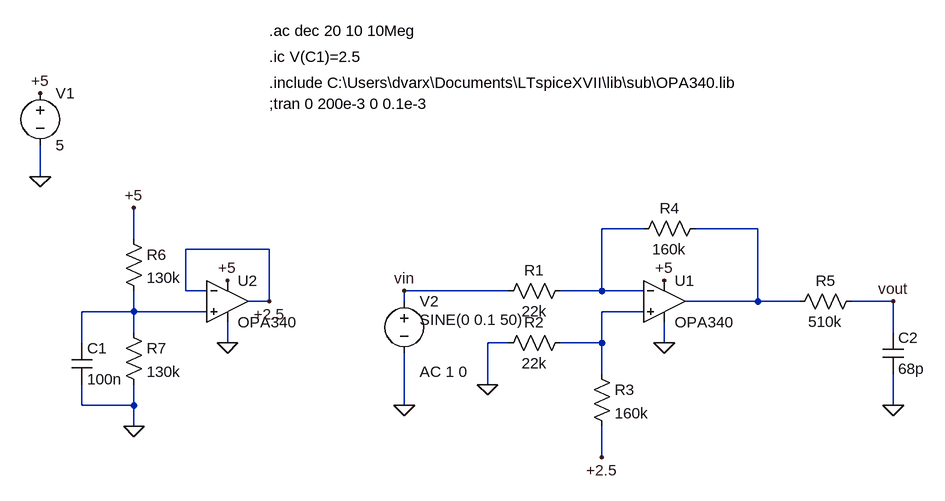
[diagram p0: schematic current_sensor.asc]
current_sensor.asc, the LTspice schematic file:
Version 4
SHEET 1 880 680
WIRE -768 -32 -768 -80
WIRE 160 48 96 48
WIRE 336 48 240 48
WIRE -624 64 -624 16
WIRE -416 80 -544 80
WIRE -544 144 -544 80
WIRE -512 144 -544 144
WIRE -48 144 -208 144
WIRE 96 144 96 48
WIRE 96 144 32 144
WIRE 160 144 96 144
WIRE -416 160 -416 80
WIRE -416 160 -448 160
WIRE -208 160 -208 144
WIRE 336 160 336 48
WIRE 336 160 224 160
WIRE 400 160 336 160
WIRE 544 160 480 160
WIRE -624 176 -624 144
WIRE -624 176 -704 176
WIRE -512 176 -624 176
WIRE 160 176 96 176
WIRE -624 208 -624 176
WIRE 544 208 544 160
WIRE -704 224 -704 176
WIRE -480 224 -480 192
WIRE -48 224 -80 224
WIRE 96 224 96 176
WIRE 96 224 32 224
WIRE 192 224 192 192
WIRE 96 272 96 224
WIRE -80 288 -80 224
WIRE -704 320 -704 288
WIRE -624 320 -624 288
WIRE -624 320 -704 320
WIRE -208 320 -208 240
WIRE 544 320 544 272
WIRE -624 352 -624 320
WIRE 96 400 96 352
FLAG -768 -32 0
FLAG 192 224 0
FLAG -480 224 0
FLAG -768 -160 +5
FLAG -480 128 +5
FLAG -624 16 +5
FLAG -624 352 0
FLAG -416 160 +2.5
FLAG 192 128 +5
FLAG 96 400 +2.5
FLAG -80 288 0
FLAG -208 320 0
FLAG -208 144 vin
FLAG 544 320 0
FLAG 544 160 vout
SYMBOL res 48 128 R90
WINDOW 0 0 56 VBottom 2
WINDOW 3 32 56 VTop 2
SYMATTR InstName R1
SYMATTR Value 22k
SYMBOL res 48 208 R90
WINDOW 0 0 56 VBottom 2
WINDOW 3 32 56 VTop 2
SYMATTR InstName R2
SYMATTR Value 22k
SYMBOL res 80 256 R0
SYMATTR InstName R3
SYMATTR Value 160k
SYMBOL res 256 32 R90
WINDOW 0 0 56 VBottom 2
WINDOW 3 32 56 VTop 2
SYMATTR InstName R4
SYMATTR Value 160k
SYMBOL Opamps\\opamp2 -480 96 R0
SYMATTR InstName U2
SYMATTR Value OPA340
SYMBOL voltage -768 -176 R0
WINDOW 123 0 0 Left 0
WINDOW 39 0 0 Left 0
SYMATTR InstName V1
SYMATTR Value 5
SYMBOL res -640 48 R0
SYMATTR InstName R6
SYMATTR Value 130k
SYMBOL res -640 192 R0
SYMATTR InstName R7
SYMATTR Value 130k
SYMBOL cap -720 224 R0
SYMATTR InstName C1
SYMATTR Value 100n
SYMBOL Opamps\\opamp2 192 96 R0
SYMATTR InstName U1
SYMATTR Value OPA340
SYMBOL voltage -208 144 R0
WINDOW 123 24 124 Left 2
WINDOW 39 0 0 Left 0
WINDOW 3 24 44 Left 2
SYMATTR Value2 AC 1 0
SYMATTR InstName V2
SYMATTR Value SINE(0 0.1 50)
SYMBOL res 496 144 R90
WINDOW 0 0 56 VBottom 2
WINDOW 3 32 56 VTop 2
SYMATTR InstName R5
SYMATTR Value 510k
SYMBOL cap 528 208 R0
SYMATTR InstName C2
SYMATTR Value 68p
TEXT -416 -216 Left 2 !.ic V(C1)=2.5
TEXT -416 -256 Left 2 !.ac dec 20 10 10Meg
TEXT -416 -144 Left 2 !;tran 0 200e-3 0 0.1e-3
TEXT -416 -176 Left 2 !.include C:\\Users\\dvarx\\Documents\\LTspiceXVII\\lib\\sub\\OPA340.lib

The netlist it stands for:
* current_sensor.asc
R1 N001 vin 22k
R2 N004 0 22k
R3 N004 +2.5 160k
R4 N002 N001 160k
XU2 N003 +2.5 +5 0 +2.5 OPA340  ; pins In+ In- V+ V- OUT
V1 +5 0 5
R6 +5 N003 130k
R7 N003 0 130k
C1 N003 0 100n
XU1 N004 N001 +5 0 N002 OPA340  ; pins In+ In- V+ V- OUT
V2 vin 0 SINE(0 0.1 50) AC 1 0
R5 vout N002 510k
C2 vout 0 68p
.ic V(C1)=2.5
.ac dec 20 10 10Meg
;tran 0 200e-3 0 0.1e-3
.include C:\Users\dvarx\Documents\LTspiceXVII\lib\sub\OPA340.lib
.backanno
.end